# EAGLE design TurntableStrobe2 (EAGLE 7.1.0)
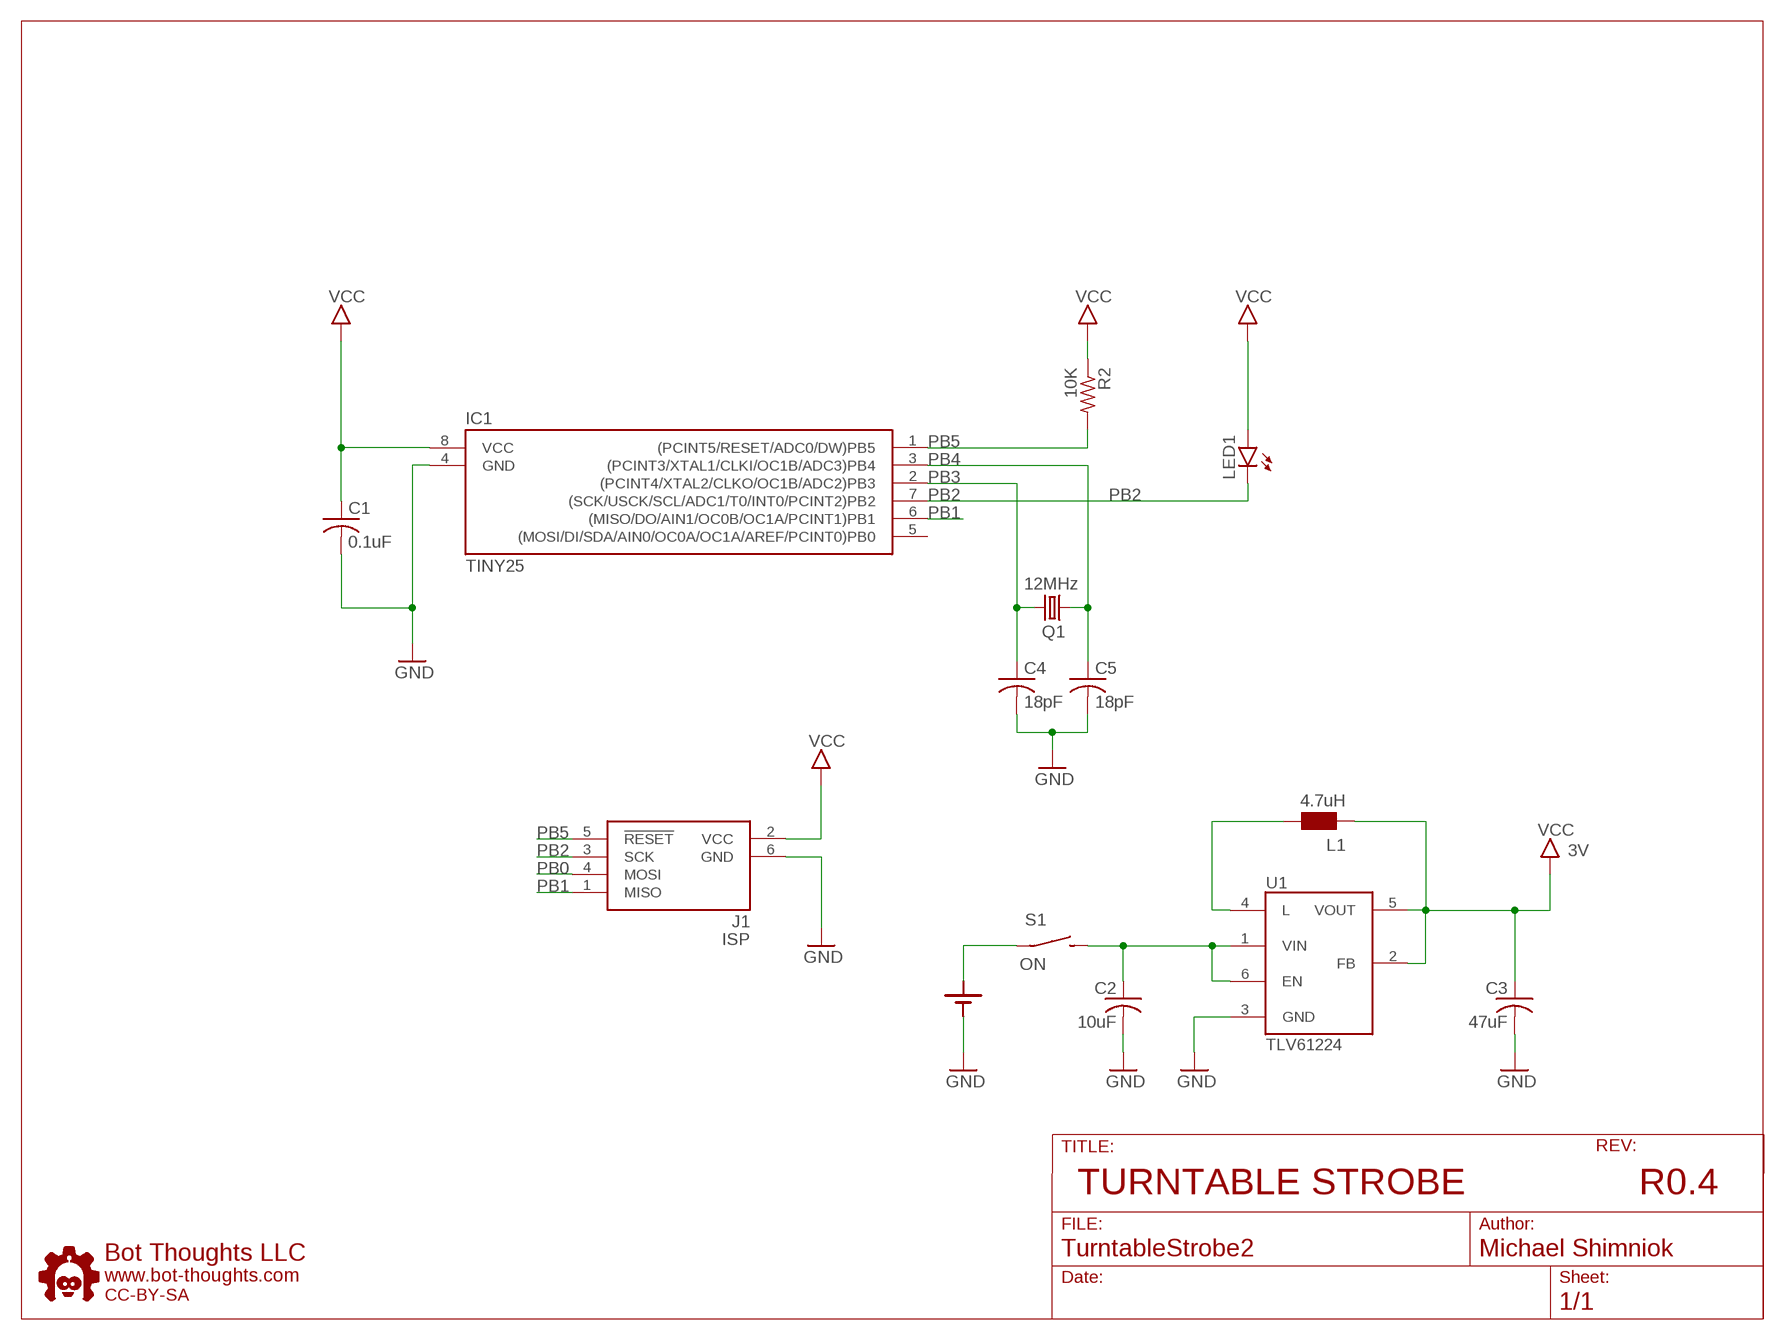
[diagram p0: schematic, sheet 1]

## Parts
C1  0.1uF  C-USC0603  [C0603]
C2  10uF  C-USC0603  [C0603]
C3  47uF  C-1206  [1206]
C4  18pF  C-USC0603  [C0603]
C5  18pF  C-USC0603  [C0603]
CR1225  LR44_PTH  [LR44]
IC1  TINY25  TINY25-20SSU  [SOIC8N]
J1  ISP  AVRISP6_TP  [2X3_TP]
L1  4.7uH  WE-MI_0805  [0805]
LED1  LED5MMRA  [LED5MMRA]
Q1  12MHz  CRYSTALNDK5X3  [NDK_2PAD_5X3]
R2  10K  R-US_R0603  [R0603]
S1  ON  SPST_TAC_RECT1  [6MMTACTILE_RECT]
U1  TLV61224  [SC70-6]
U$5  BTLOGO-LOGO-MD  [BTLOGOM]

## Nets
GND: C1.2 C2.2 C3.2(-) C4.2 C5.2 CR1225.GND(-) IC1.4(GND) J1.6(GND) U1.3(GND)
N$2: L1.2 U1.4(L)
PB0: J1.4(MOSI)
PB1: IC1.6((MISO/DO/AIN1/OC0B/OC1A/PCINT1)PB1) J1.1(MISO)
PB2: IC1.7((SCK/USCK/SCL/ADC1/T0/INT0/PCINT2)PB2) J1.3(SCK) LED1.C
PB3: C4.1 IC1.2((PCINT4/XTAL2/CLKO/OC1B/ADC2)PB3) Q1.P$2
PB4: C5.1 IC1.3((PCINT3/XTAL1/CLKI/OC1B/ADC3)PB4) Q1.P$1
PB5: IC1.1((PCINT5/RESET/ADC0/DW)PB5) J1.5(!RESET) R2.2
VBAT: CR1225.+1(+) CR1225.+2(+) S1.P$1(P)
VCC: C1.1 C3.1(+) IC1.8(VCC) J1.2(VCC) L1.1 LED1.A R2.1 U1.2(FB) U1.5(VOUT) ; supply symbol labelled 3V
VIN: C2.1 S1.P$2(S) U1.1(VIN) U1.6(EN)
Unconnected: IC1.5((MOSI/DI/SDA/AIN0/OC0A/OC1A/AREF/PCINT0)PB0)

## Notes on the sheet
- TURNTABLE STROBE | R0.4

## Library data of the parts
C1 C2 C4 C5 = rcl:C-US: CAPACITOR, American symbol
C3 = bt_rcl:C: Capacitor, non-polarized, American symbol
CR1225 = bt_battery:LR44: LR44 1.5V Coin Cell Battery
IC1 = bt_avr:TINY25: Atmel AVR ATiny25,45,85 8-bit Microcontroller.
J1 = bt_avr:AVRISP6: 6-pin dual-row connector for Atmel AVRISP programmer interface
L1 = wuerth-elektronik:WE-MI: SMD Multilayer Inductor WE-MI - Excellent solderability and high heat resistance -- Filter switches -- Oscillators -- Adjustment networks -- Discretely built T- or Pi-Filter
LED1 = bt_opto:LED: LED Various packages
Q1 = bt_crystal:CRYSTAL: CRYSTAL
R2 = rcl:R-US_: RESISTOR, American symbol
S1 = bt_electromech:SPST: SPST SWITCH
U1 = bt_regulator:TLV61224: TLV61224 Single-Cell, High-Efficient, Step-Up Converter in 6-Pin SC-70 Package The TLV61224 device provides a power-supply solution for products powered by either a single-cell or 2-cell alkaline or NiMH, or 1-cell Li-primary battery. datasheet.pdf <http://www.ti.com/lit/ds/symlink/tlv61224.pdf>
U$5 = bt:BTLOGO: Bot Thoughts Logo

## Board
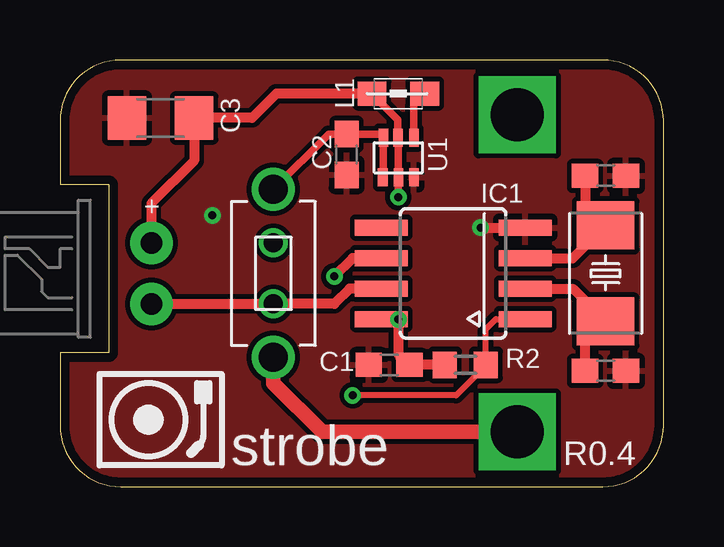
[diagram p1: board, top side]
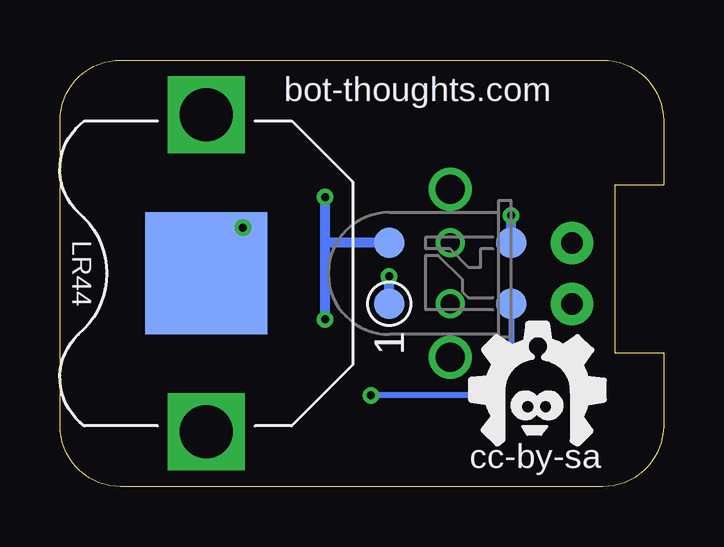
[diagram p2: board, bottom side, seen from below]

Size 25.15 x 17.78 mm. Coordinates in mm from the lower left corner, seen from the top.
Outline: 25.15,2.54 25.15,15.24 arc90 22.61,17.78 2.54,17.78 arc90 0,15.24 0,12.57 2.03,12.57 2.03,5.59 0,5.59 0,2.54 arc90 2.54,0 22.61,0 arc90 25.15,2.54
Copper layers (1*16): Top 0.0356mm / dielectric 1.5011mm / Bottom 0.0356mm
Design rules "default *": minimum track width 6mil, minimum drill 13mil, track to track 6mil, track to pad 6mil, pad to pad 6mil, via to via 6mil, smd to smd 6mil, copper to edge 15mil, drill to drill 6mil, minimum pad ring 7mil, minimum via ring 7mil, stop-mask expansion 4mil, vias tented up to drill 20mil, thermal gap 10mil

### Footprints (pad centres in the part's own frame; a part is rotated, then mirrored left to right if it is on the bottom)
C0603 = smd 1.1 x 1: 1 -0.85,0; 2 0.85,0
1206 = smd 1.6 x 1.8: 1 -1.4,0; 2 1.4,0
LR44 = drill 2.2 square: +1 6.604,0; +2 -6.604,0 | smd 5.08 x 5.08: GND 0,0
SOIC8N = smd 0.66 x 2.2: 1 -1.905,-3; 2 -0.635,-3; 3 0.635,-3; 4 1.905,-3; 5 1.905,3; 6 0.635,3; 7 -0.635,3; 8 -1.905,3
2X3_TP = smd 1.27 x 1.27: 1 -1.27,2.54; 2 1.27,2.54; 5 -1.27,-2.54; 6 1.27,-2.54 | drill 0.8: 3 -1.27,0; 4 1.27,0
0805 = smd 1.2 x 1: 1 -1.1,0; 2 1.1,0
LED5MMRA = drill 0.9 pad 1.778: A 0,1.27; C 0,-1.27
NDK_2PAD_5X3 = smd 2 x 2.4: P$1 -2,0; P$2 2,0
R0603 = smd 1 x 1.1: 1 -0.85,0; 2 0.85,0
6MMTACTILE_RECT = drill 1.2: P$1 -3.5,0; P$2 3.5,0
SC70-6 = smd 0.4 x 0.75: 1 -0.65,-0.825; 2 0,-0.825; 3 0.65,-0.825; 4 0.65,0.825; 5 -0.015,0.825; 6 -0.62,0.825

### Placement (x,y rotation side)
C1  13.72,5.08 180 top
C2  11.94,13.84 270 top
C3  4.19,15.37 180 top
C4  22.73,4.83 0 top
C5  22.73,12.95 0 top
CR1225  19.05,8.89 90 bottom
IC1  16.38,8.89 90 top
J1  8.89,8.89 90 bottom
L1  14.1,16.38 0 top
LED1  3.81,8.89 0 top
Q1  22.73,8.89 270 top
R2  16.89,5.08 0 top
S1  8.89,8.89 90 top
U1  14.1,13.72 0 top
U$5  5.33,1.52 0 bottom

### Tracks (layer width: path | path; a pad name or v marks a point on that pad's centre or on a via)
GND  (via drill 0.33)
  Top 0.406: v17.53,10.79 IC1.4
  Bottom 0.406: J1.6 v6.35,11.3 | CR1225.GND v17.53,10.79
  pour Top (isolate 0.203): 2.54,0 22.61,0 arc90 25.15,2.54 25.15,15.24 arc90 22.61,17.78 2.54,17.78 arc90 0,15.24 0,2.54 arc90
N$2
  Top 0.305: U1.4 14.75,15.93 L1.2
PB1  (via drill 0.33)
  Top 0.406: v11.43,8.76 12.19,9.53 IC1.6
  Bottom 0.406: J1.1 v11.43,8.76
PB2
  Top 0.406: LED1.C J1.3 11.43,7.62 12.06,8.26 IC1.7
PB3
  Top 0.406: IC1.2 21.38,8.24 Q1.P$2 21.88,6.04 C4.1
PB4
  Top 0.406: IC1.3 21.36,9.52 Q1.P$1 21.88,11.74 C5.1
PB5  (via drill 0.33)
  Top 0.254: v12.19,3.81 16.51,3.81 17.65,4.95 R2.2 17.74,6.57 18.16,6.99 IC1.1
  Bottom 0.254: J1.5 6.35,5.46 8,3.81 v12.19,3.81
VBAT
  Top 0.61: S1.P$1 8.89,4.32 10.92,2.29 CR1225.+2
VCC  (via drill 0.33)
  Top 0.305: v14.1,12.06 U1.2 14.1,14.53 U1.5 14.08,15.3 L1.1
  Top 0.406: R2.1 C1.1 14.1,5.5 v14.1,6.97 IC1.8 | L1.1 9.02,16.38 8,15.37 C3.1 5.59,13.59 3.81,11.81 LED1.A
  Bottom 0.406: 11.25,10.16 J1.2 14.1,10.16 | v14.1,6.97 14.1,10.16 | 14.1,10.16 v14.1,12.06
VIN
  Top 0.305: U1.1 13.48,12.92 U1.6 13.32,14.69 C2.1 11.19,14.69 S1.P$2

### Text on the board
tNames: strobe | R0.4
bNames: bot-thoughts.com | cc-by-sa
tsilk: R1 | C3 | C2 | R0.2 | R3 | IC1 | + | C1 | R2 | Strobe | 50.0Hz
bsilk: bot-thoughts.com | ISP | 1 | CR1225